# EasyEDA Pro project PowerManager.eprj

# Schematic Schematic1
Create Date: 2024-06-30; Page Name: P1; Project Name: PowerManager; Schematic Name: Schematic1; Update Date: 2024-08-08; Company: 嘉立创EDA; Page Size: A4; Version: V1.0
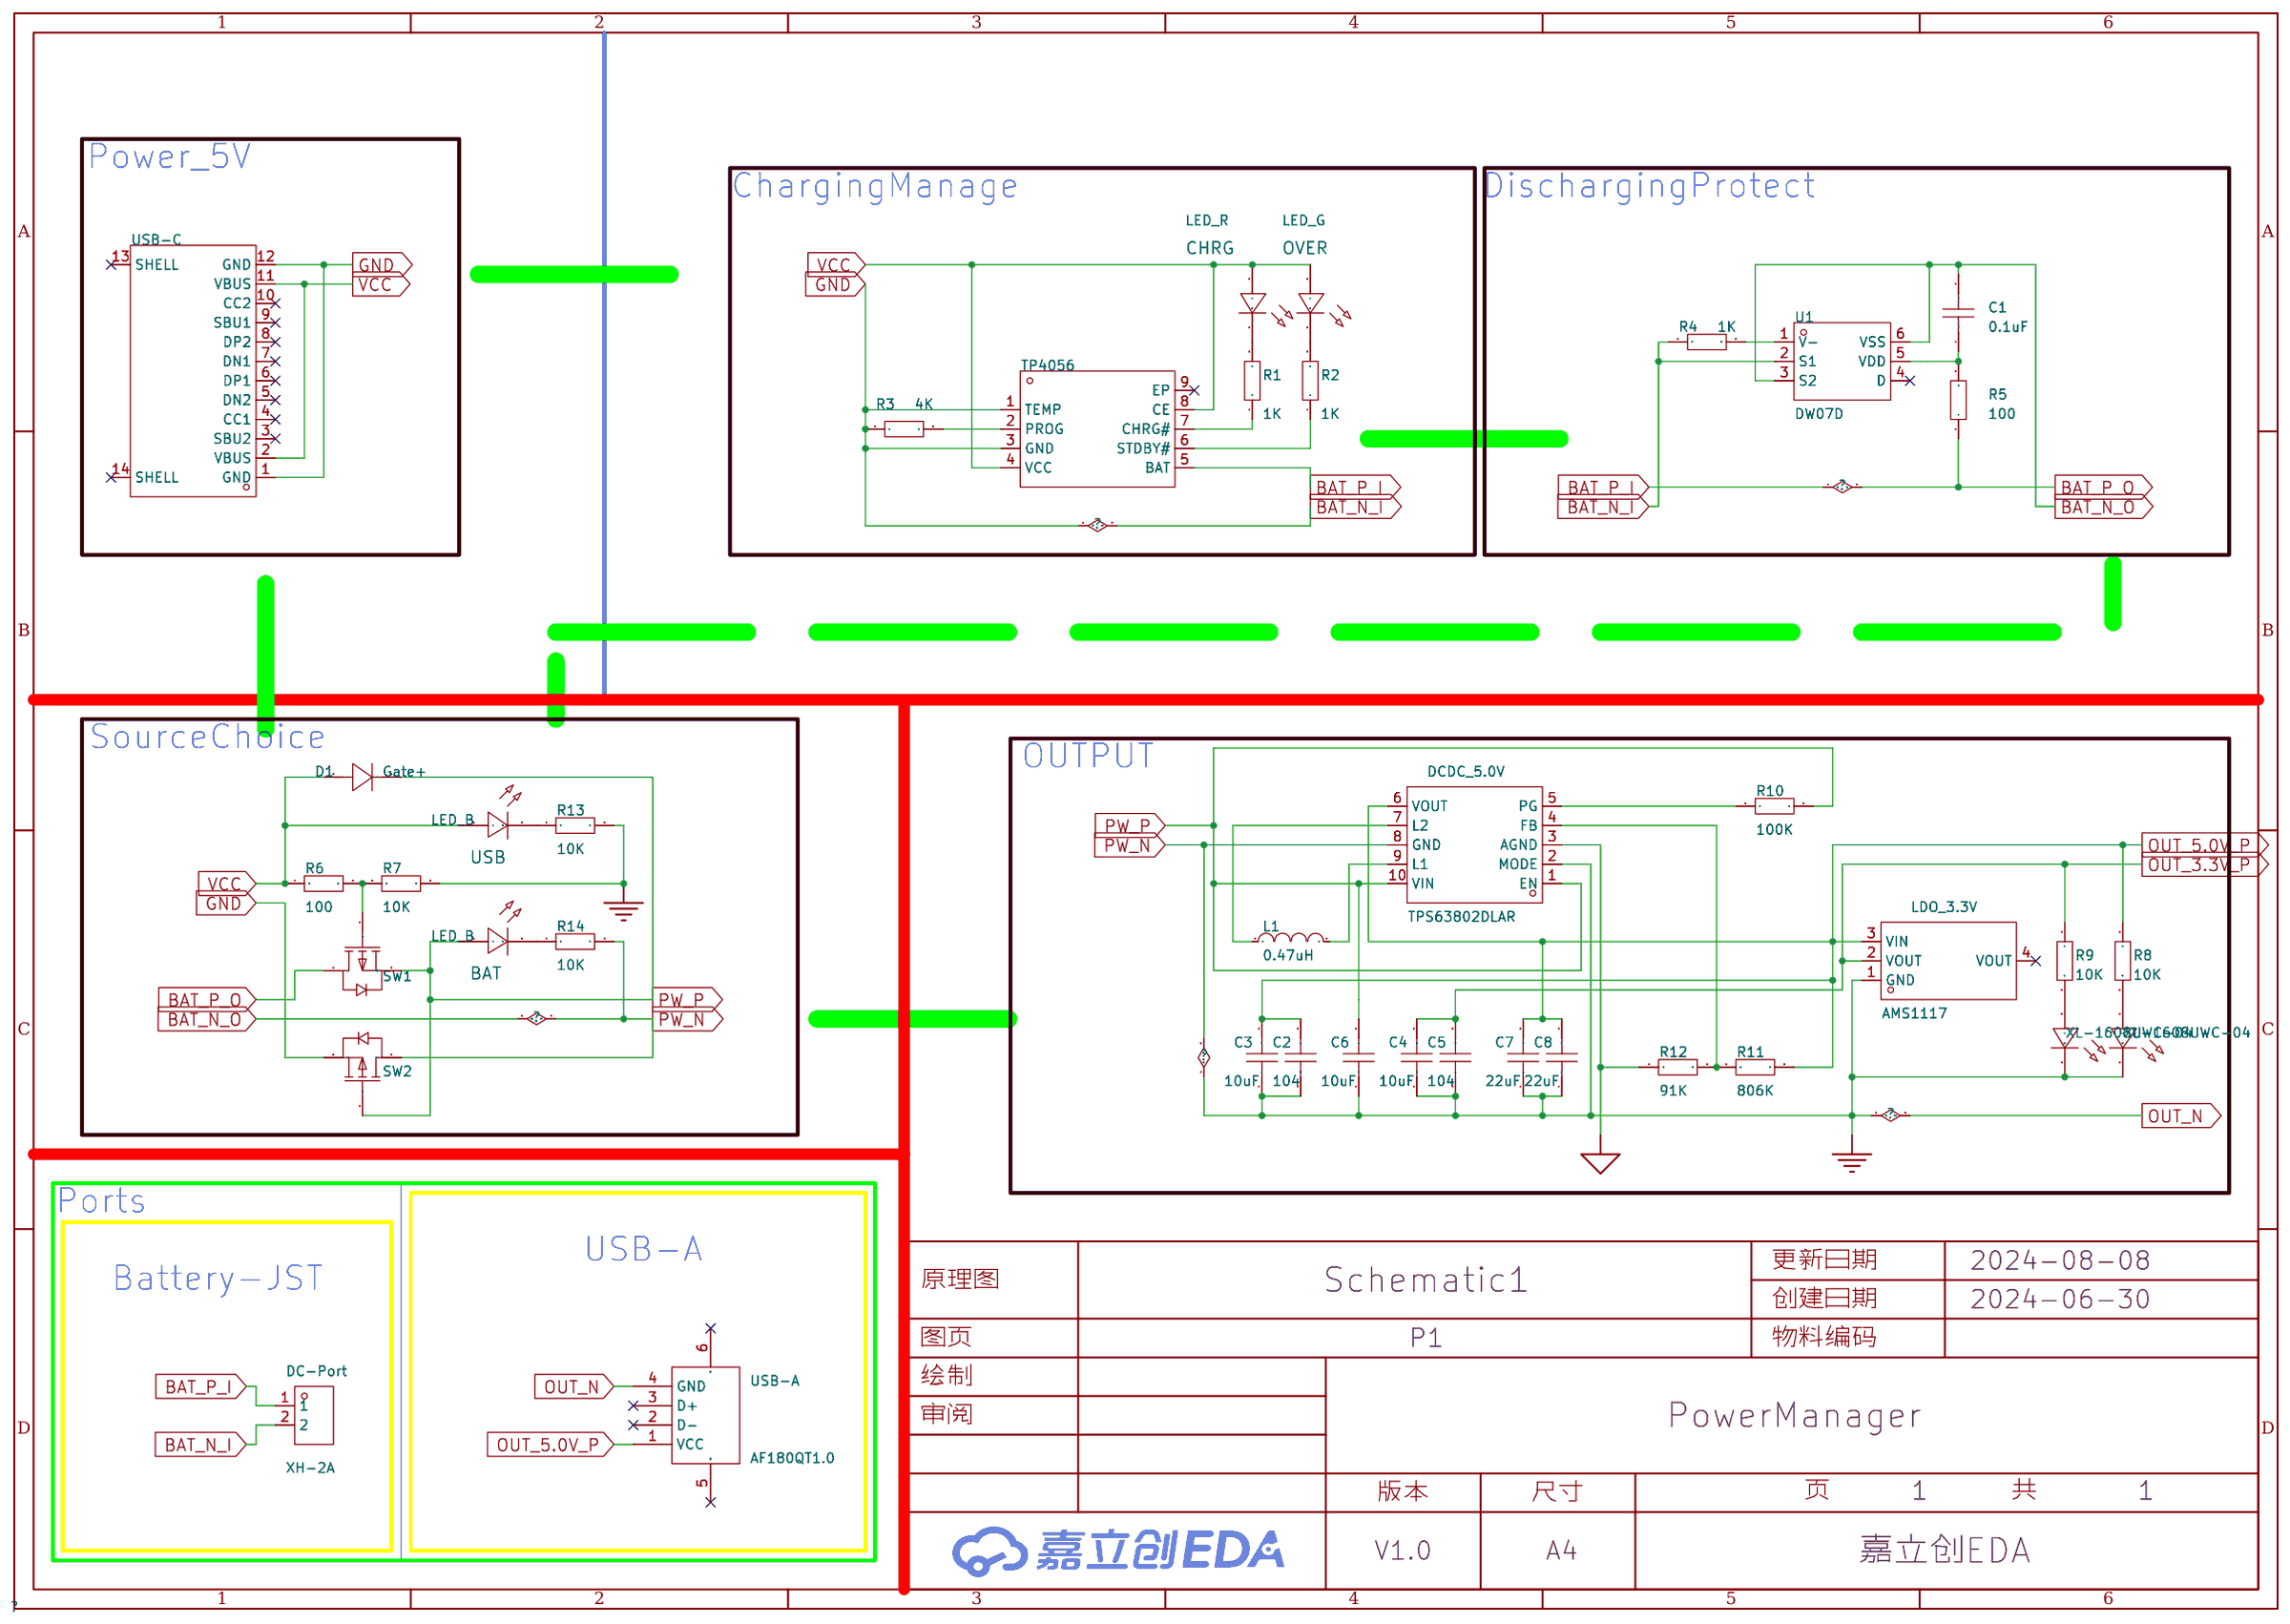
[diagram p0: schematic sheet]

## Parts
3.3V  XL-1608UWC-04  [LED0603-RD_WHITE]
5.0V  XL-1608UWC-04  [LED0603-RD_WHITE]
BAT  LED_B  [LED0603-RD_BLUE]
C1  0.1uF  [C0603]
C2  104  [C0603]
C3  10uF  [C0603]
C4  104  [C0603]
C5  10uF  [C0603]
C6  10uF  [C0603]
C7  22uF  [C0603]
C8  22uF  [C0603]
CHRG  LED_R  [LED_0603]
DC-Port  XH-2A  [CONN-TH_2P-P2.50_HCTL_XH-2A-X]
DCDC_5.0V  TPS63802DLAR  [VSON-10_L3.0-W2.0-P0.50-TL]
Gate+  D1  [SMA_1N4007]
L1  0.47uH  [L0603]
LDO_3.3V  AMS1117  [SOT-223-3_L6.5-W3.4-P2.30-LS7.0-BR]
OVER  LED_G  [LED0603-RD_GREEN]
R1  1K  [R0603]
R2  1K  [R0603]
R3  4K  [R0603]
R4  1K  [R0603]
R5  100  [R0603]
R6  100  [R0603]
R7  10K  [R0603]
R8  10K  [R0603]
R9  10K  [R0603]
R10  100K  [R0603]
R11  806K  [R0603]
R12  91K  [R0603]
R13  10K  [R0603]
R14  10K  [R0603]
SW1  AO3401A  [SOT-23_L2.9-W1.3-P1.90-LS2.4-BR]
SW2  AO3401A  [SOT-23_L2.9-W1.3-P1.90-LS2.4-BR]
TP4056  TP4056  [ESOP-8_L4.9-W3.9-P1.27-LS6.0-BL-EP]
Type-C  USB-C  [USB-C-SMD_TYPE-C-6PIN-2MD-073]
U1  DW07D  [SOT-23-6_L2.9-W1.6-P0.95-LS2.8-BR]
USB  LED_B  [LED0603-RD_BLUE]
USB-A  AF180QT1.0  [USB-A-SMD_AF180QT1.0]

## Library data of the parts
3.3V 5.0V = XL-1608UWC-04: 发光颜色:白色;功率:80mW;正向电流:25mA;主波长:-;透镜颜色:黄色透镜;色温:13700K~19000K;发光角度:120°;载带方式:正贴;工作温度:-30℃~+85℃;; Supplier Part: C965808; Manufacturer: XINGLIGHT(成兴光); Supplier Footprint: 0603; JLCPCB Part Class: Extended Part; Datasheet: https://atta.szlcsc.com/upload/public/pdf/source/20221102/585FFDAF9A16AAB1CA7BDF9640D81A72.pdf; Supplier: LCSC; Emitted Color: 白色; Power Dissipation: 80mW; Forward Current: 25mA; Lens Color: 黄色透镜; Color Temperature: 13700K~19000K; Viewing Angle: 120°; Mounting Sytle: 正贴; Operating Temperature: -30℃~+85℃
BAT USB = XL-1608UBC-04: 发光颜色:蓝色;功率:80mW;正向电流:25mA;主波长:460nm~469nm;透镜颜色:无色透明透镜;色温:-;发光角度:120°;载带方式:正贴;工作温度:-30℃~+85℃;; Supplier Part: C965807; Manufacturer: XINGLIGHT(成兴光); Supplier Footprint: 0603; JLCPCB Part Class: Extended Part; Datasheet: https://atta.szlcsc.com/upload/public/pdf/source/20240218/F76B043D1CDACE9DB8357580572EF0D5.pdf; Supplier: LCSC; Emitted Color: 蓝色; Power Dissipation: 80mW; Forward Current: 25mA; Dominant Wavelength: 460nm~469nm; Peak Wavelength: 475nm; Lens Color: 无色透明透镜; Viewing Angle: 120°; Mounting Sytle: 正贴; Operating Temperature: -30℃~+85℃
C1-C8 = CAP_0603: Supplier Footprint: 0603
CHRG = LED_0603-R: Supplier Footprint: 0603
DC-Port = XH-2A: 插针结构:1x2P;间距:2.5mm;安装方式:直插;参考系列:XH;总PIN数:2P;排数:1;每排PIN数:2;行距:-;额定电流:3A;触头材质:黄铜;触头镀层:锡;工作温度范围:-25℃~+85℃;; LCSC Part Name: 1x2P 间距:2.5mm 直插 系列:XH; Supplier Part: C2908600; Manufacturer: HCTL(华灿天禄); Supplier Footprint: 插件,P=2.5mm; Datasheet: https://atta.szlcsc.com/upload/public/pdf/source/20230711/68D365716984B4AFE576D1D73D61B465.pdf; Supplier: LCSC; Pins Structure: 1x2P; Pitch: 2.5mm; Mounting Style: 直插; Reference Series: XH; Number of Pins: 2P; Number of Rows: 1; Number of PINs Per Row: 2; Current Rating (Max): 3A; Contact Material: 黄铜; Contact Plating: 锡; Operating Temperature Range: -25℃~+85℃
DCDC_5.0V = TPS63802DLAR_C2845237: Supplier Part: C2845237; Manufacturer: TI(德州仪器); Supplier Footprint: VSON-10(2x3); Datasheet: https://www.ti.com/cn/lit/gpn/tps63802; Supplier: LCSC
Gate+ = D_1N4007: Supplier Footprint: SMA
L1 = L_0603
LDO_3.3V = AMS1117-3.3_C6186: 输出类型:固定;最大输入电压:-;输出电压:3.3V;最大输出电流:1A;电源纹波抑制比(PSRR):72dB@(120Hz);输出极性:正极;; LCSC Part Name: 输出3.3V 1A; Supplier Part: C6186; Manufacturer: AMS; Supplier Footprint: SOT-223; Datasheet: https://atta.szlcsc.com/upload/public/pdf/source/20180727/C6186_7A095716F0823C02F1997A905E26C086.pdf; Supplier: LCSC; Output Type: 固定; Output Voltage: 3.3V; MAX Output Current: 1A; Power Supply Rejection Ratio (PSRR): 72dB@(120Hz); Dropout Voltage: 1.3V@(800mA); Output Polarity: 正极; Number of Outputs: 1
OVER = XL-1608UGC-04: 灯头类型:-;发光颜色:翠绿色;正向电压(VF):-;功率:80mW;正向电流:25mA;主波长:516nm~525nm;二极管配置:独立二极管;透镜颜色:无色透明透镜;色温:-;发光强度:-;发光角度:120°;载带方式:正贴;工作温度:-30℃~+85℃;; Supplier Part: C965804; Manufacturer: XINGLIGHT(成兴光); Manufacturer Part: LED_R; Supplier Footprint: 0603; JLCPCB Part Class: Extended Part; Datasheet: https://atta.szlcsc.com/upload/public/pdf/source/20221102/520D6E465E5CFD1609C8A4DBC80D4018.pdf; Supplier: LCSC; Emitted Color: 翠绿色; Power Dissipation: 80mW; Forward Current: 25mA; Dominant Wavelength: 516nm~525nm; Peak Wavelength: 534nm; Diode Configuration: 独立二极管; Lens Color: 无色透明透镜; Viewing Angle: 120°; Mounting Sytle: 正贴; Operating Temperature: -30℃~+85℃
R1-R14 = Res_0603: Supplier Footprint: 0603
SW1 SW2 = AO3401A_C15127: 类型:1个P沟道;漏源电压(Vdss):30V;连续漏极电流(Id):4A;功率(Pd):1.4W;导通电阻(RDS(on)@Vgs,Id):44mΩ@10V,4.3A;阈值电压(Vgs(th)@Id):1.3V@250uA;; LCSC Part Name: 1个P沟道 耐压:30V 电流:4A; Supplier Part: C15127; Manufacturer: AOS; Supplier Footprint: SOT-23; Datasheet: https://atta.szlcsc.com/upload/public/pdf/source/20160507/1462613609053.pdf; Supplier: LCSC; Type: 1个P沟道; Drain Source Voltage (Vdss): 30V; Continuous Drain Current (Id): 4A; Power Dissipation (Pd): 1.4W; Drain Source On Resistance (RDS(on)@Vgs,Id): 44mΩ@10V,4.3A; Gate Threshold Voltage (Vgs(th)@Id): 1.3V@250uA; Total Gate Charge (Qg@Vgs): 12.2nC@4.5V; Input Capacitance (Ciss@Vds): 1.2nF@15V; Operating Temperature: -55℃~+150℃@(Tj)
TP4056 = TP4056_C725790: Supplier Part: C725790; Manufacturer: UMW(友台半导体); Supplier Footprint: ESOP-8; Datasheet: https://atta.szlcsc.com/upload/public/pdf/source/20231109/CF74897CE79A500F7FE27A45ADCCC631.pdf; Supplier: LCSC
Type-C = TYPE-C 16PIN 2MD(073): 连接器类型:Type-C;标准:-;公母:母;端口数量:1;触点数量:16P;安装方式:卧贴;额定电流 - 电源:5A;工作温度范围:-25℃~+85℃;; LCSC Part Name: Type-C 母 卧贴; Supplier Part: C2765186; Manufacturer: SHOU HAN(首韩); Supplier Footprint: SMD; Datasheet: https://atta.szlcsc.com/upload/public/pdf/source/20211123/39B17C16241EAC15C5E277BDA434118E.pdf; Supplier: LCSC; Gender: 母; Number of Ports: 1; Number of Contacts: 16P; Mounting Style: 卧贴; Current Rating - Power (Max): 5A; Operating Temperature Range: -25℃~+85℃
U1 = DW07D: 二合一锂电池保护IC; Supplier Part: C89497; Manufacturer: FM(富满); Supplier Footprint: SOT-23-6; JLCPCB Part Class: 扩展库; Datasheet: https://atta.szlcsc.com/upload/public/pdf/source/20161128/1480332603746.pdf; Supplier: LCSC
USB-A = AF180QT1.0: 连接器类型:Type-A;标准:USB 2.0;公母:母;端口数量:1;触点数量:4P;安装方式:卧贴;额定电流 - 电源:-;工作温度范围:-;; LCSC Part Name: Type-A 母 卧贴; Supplier Part: C404963; Manufacturer: SHOU HAN(首韩); Supplier Footprint: SMD; Datasheet: https://atta.szlcsc.com/upload/public/pdf/source/20190722/C404963_FD7C48D0FD141784D3899E0BE1E5ED69.pdf; Supplier: LCSC; Connector Type: Type-A; Standard: USB 2.0; Gender: 母; Number of Ports: 1; Number of Contacts: 4P; Mounting Style: 卧贴

## Nets
AGND: DCDC_5.0V.3(AGND) R12.1
DGND: 3.3V.1(C) 5.0V.1(C) C1.2 C2.1 C3.1 C4.1 C5.1 C6.1 C7.1 C8.1 DCDC_5.0V.2(MODE) DCDC_5.0V.8(GND) LDO_3.3V.1(GND) R14.2 SW2.3(D) U1.3(S2) U1.6(VSS) USB-A.4(GND)
GND: DC-Port.2 R3.1 R4.1 R7.2 R13.2 SW2.2(S) TP4056.1(TEMP) TP4056.3(GND) Type-C.1(GND) Type-C.12(GND) U1.2(S1)
VCC: CHRG.2(A) Gate+.2(A) OVER.2(A) R6.1 TP4056.4(VCC) TP4056.8(CE) Type-C.2(VBUS) Type-C.11(VBUS) USB.2(A)
BAT_P_I: DC-Port.1 R5.1 SW1.3(D) TP4056.5(BAT)
OUT_3.3V_P: C4.2 C5.2 LDO_3.3V.2(VOUT) R9.1
OUT_5.0V_P: C2.2 C3.2 C7.2 C8.2 DCDC_5.0V.6(VOUT) LDO_3.3V.3(VIN) R8.1 R11.2 USB-A.1(VCC)
PW_P: BAT.2(A) C6.2 DCDC_5.0V.1(EN) DCDC_5.0V.10(VIN) Gate+.1(K) R10.1 SW1.2(S) SW2.1(G)
$1N753: R3.2 TP4056.2(PROG)
$1N897: OVER.1(C) R2.2
$1N964: CHRG.1(C) R1.2
$1N968: R1.1 TP4056.7(CHRG#)
$1N975: R2.1 TP4056.6(STDBY#)
$1N1874: R6.2 R7.1 SW1.1(G)
$1N7526: 5.0V.2(A) R8.2
$1N7553: 3.3V.2(A) R9.2
$1N9793: DCDC_5.0V.9(L1) L1.2
$1N9797: DCDC_5.0V.7(L2) L1.1
$1N10563: DCDC_5.0V.5(PG) R10.2
$1N11159: DCDC_5.0V.4(FB) R11.1 R12.2
$1N18992: R13.1 USB.1(C)
$1N19087: BAT.1(C) R14.1
$1N21323: R4.2 U1.1(V-)
$1N21351: C1.1 R5.2 U1.5(VDD)

Not connected (* = marked no-connect by the designer): LDO_3.3V 4(VOUT)*; TP4056 9(EP)*; Type-C 3(SBU2)* 4(CC1)* 5(DN2)* 6(DP1)* 7(DN1)* 8(DP2)* 9(SBU1)* 10(CC2)* 13(SHELL)* 14(SHELL)*; U1 4(D)*; USB-A 2(D-)* 3(D+)* 5(SH1)* 6(SH2)*

## Notes on the sheet
- Power_5V
- ChargingManage
- DischargingProtect
- SourceChoice
- OUTPUT
- Ports
- USB-A
- Battery-JST

# Board PCB1
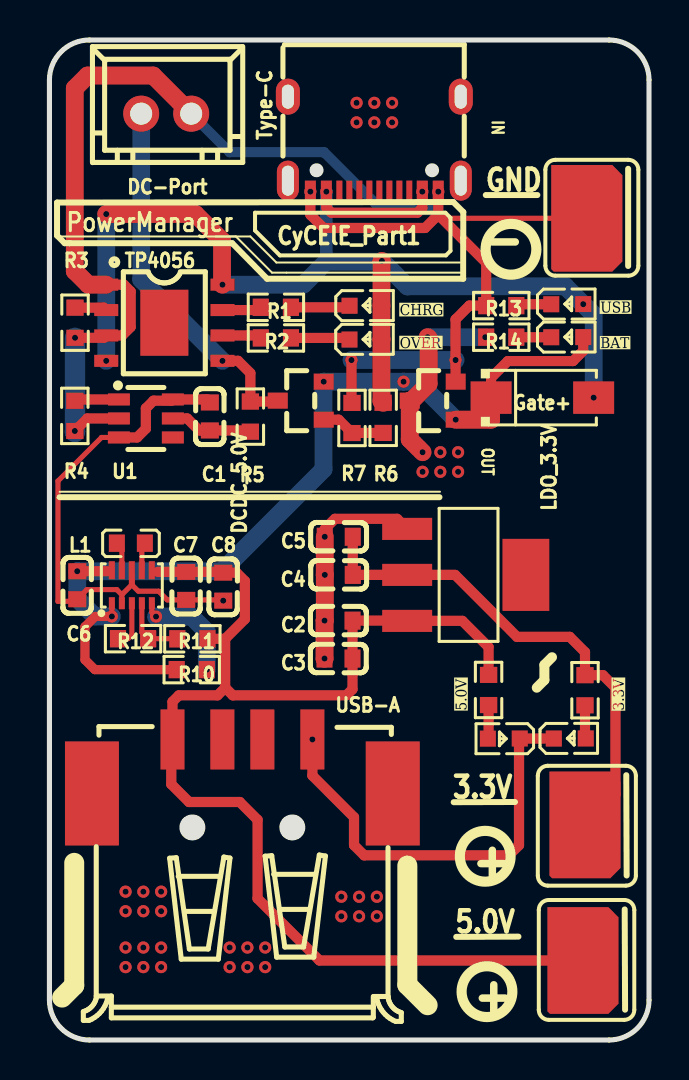
[diagram p1: board, top side]
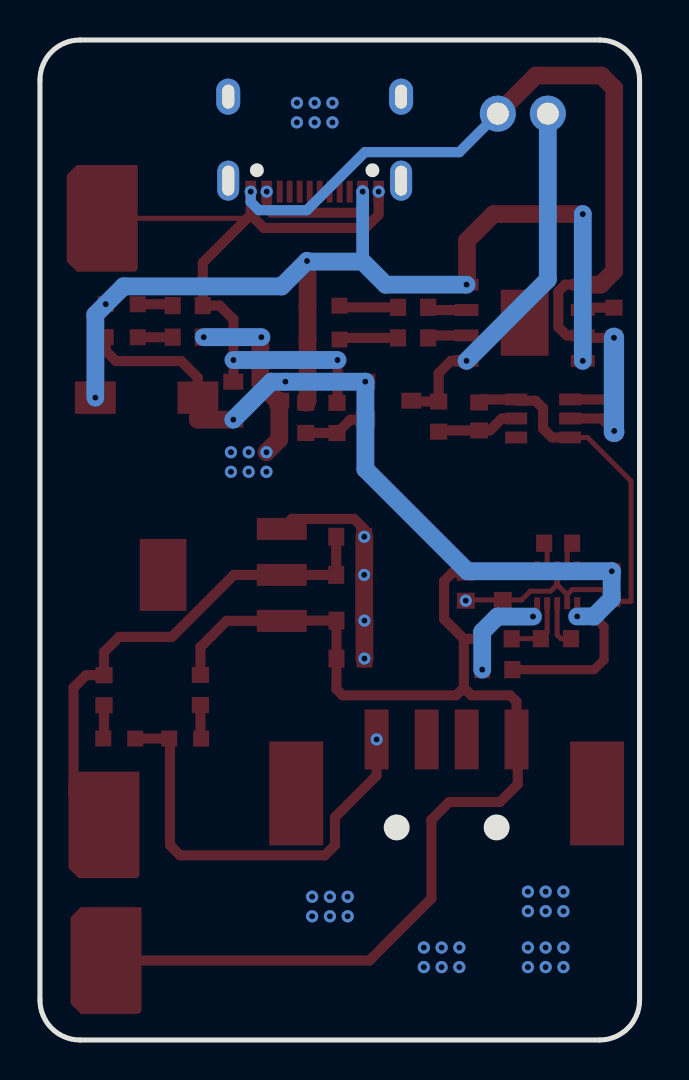
[diagram p2: board, bottom side, seen from below]

Outline 30 x 50 mm; copper layers: Top Layer, Bottom Layer. Coordinates in mm from the lower left corner of the outline.
Outline path: 0,48 0,2 arc(0.59,0.59) 2,0 28,0 arc(29.41,0.59) 30,2 30,48 arc(29.41,49.41) 28,50 2,50 arc(0.59,49.41) 0,48
Stack: Top Layer 0.035mm / Dielectric1 1.51mm FR4 er 4.5 / Bottom Layer 0.035mm

## Design rules (mm)
template: 自定义配置
spacing copperThickness1oz (default): track to track 0.102, other pairs 0.152 to 0.3
spacing copperThickness2oz: track to track 0.203, other pairs 0.152 to 0.3
track width copperThickness1oz (default): min 0.127, default 0.254, max 2.54
track width copperThickness2oz: min 0.203, default 0.254, max 2.54
differential pair differentialPair (default): width min 0.127, default 0.254, max 2.54; gap min 0.152, default 0.152
via viaSize (default): diameter min 0.5, default 0.61, max 10; hole min 0.3, default 0.305, max 6.3
pour e87 uses 全铺满

## Placement (name value [footprint] x y rotation side)
3.3V  XL-1608UWC-04  [LED0603-RD_WHITE]  26.03 15.08 0 top
5.0V  XL-1608UWC-04  [LED0603-RD_WHITE]  22.73 15.07 180 top
BAT  LED_B  [LED0603-RD_BLUE]  25.91 35.14 0 top
C1  0.1uF  [C0603]  8.03 31.18 90 top
C2  104  [C0603]  14.47 20.97 0 top
C3  10uF  [C0603]  14.46 19.07 0 top
C4  104  [C0603]  14.48 23.26 0 top
C5  10uF  [C0603]  14.48 25.16 0 top
C6  10uF  [C0603]  1.39 22.74 90 top
C7  22uF  [C0603]  6.84 22.7 90 top
C8  22uF  [C0603]  8.7 22.67 90 top
CHRG  LED_R  [LED_0603]  15.87 36.72 0 top
DC-Port  XH-2A  [CONN-TH_2P-P2.50_HCTL_XH-2A-X]  5.84 46.32 0 top
DCDC_5.0V  TPS63802DLAR  [VSON-10_L3.0-W2.0-P0.50-TL]  4.12 22.66 90 top
Gate+  D1  [SMA_1N4007]  24.66 32.12 0 top
L1  0.47uH  [L0603]  4.07 24.84 180 top
LDO_3.3V  AMS1117  [SOT-223-3_L6.5-W3.4-P2.30-LS7.0-BR]  20.87 23.26 180 top
NOREF  -  [Pad_e1452]  26.7 3.97 0 top
NOREF#2  -  [Pad_e1453]  26.89 41.08 0 top
NOREF#3  -  [Pad_e1450]  26.8 10.76 0 top
OVER  LED_G  [LED0603-RD_GREEN]  15.81 35.03 0 top
R1  1K  [R0603]  11.33 36.63 0 top
R2  1K  [R0603]  11.33 35.1 0 top
R3  4K  [R0603]  1.28 35.86 90 top
R4  1K  [R0603]  1.27 31.2 90 top
R5  100  [R0603]  10.05 31.17 270 top
R6  100  [R0603]  16.7 31.11 270 top
R7  10K  [R0603]  15.14 31.1 90 top
R8  10K  [R0603]  21.97 17.5 270 top
R9  10K  [R0603]  26.8 17.49 270 top
R10  100K  [R0603]  7.12 18.52 0 top
R11  806K  [R0603]  7.15 20.06 0 top
R12  91K  [R0603]  4.19 20.07 0 top
R13  10K  [R0603]  22.61 36.72 180 top
R14  10K  [R0603]  22.61 35.14 180 top
SW1  AO3401A  [SOT-23_L2.9-W1.3-P1.90-LS2.4-BR]  12.57 31.97 0 top
SW2  AO3401A  [SOT-23_L2.9-W1.3-P1.90-LS2.4-BR]  19.18 31.97 0 top
TP4056  TP4056  [ESOP-8_L4.9-W3.9-P1.27-LS6.0-BL-EP]  5.75 35.86 270 top
Type-C  USB-C  [USB-C-SMD_TYPE-C-6PIN-2MD-073]  16.26 44.79 180 top
U1  DW07D  [SOT-23-6_L2.9-W1.6-P0.95-LS2.8-BR]  4.83 31.08 180 top
USB  LED_B  [LED0603-RD_BLUE]  25.91 36.79 0 top
USB-A  AF180QT1.0  [USB-A-SMD_AF180QT1.0]  9.65 13.68 0 top

## Footprints (pads in the part's own frame, mm; a bottom-side part is the same pattern mirrored in y, then rotated)
C0603
  rect 0.8x0.9 smd: 1(-0.7,0) 2(0.7,0)
CONN-TH_2P-P2.50_HCTL_XH-2A-X
  round 1.8 hole 1.1: 1(-1.251,0) 2(1.251,0)
ESOP-8_L4.9-W3.9-P1.27-LS6.0-BL-EP
  rect 0.6x1.2 smd: 1(-1.905,-2.909) 2(-0.635,-2.909) 3(0.635,-2.909) 4(1.905,-2.909) 5(1.905,2.909) 6(0.635,2.909) 7(-0.635,2.909) 8(-1.905,2.909)
  rect 3.3x2.4 smd: 9(0,0)
L0603
  rect 0.8x0.864 smd: 1(-0.7,0) 2(0.7,0)
LED0603-RD_BLUE
  rect 0.8x0.8 smd: 1(-0.799,-0.004) 2(0.799,0.004)
LED0603-RD_GREEN
  rect 0.8x0.8 smd: 1(-0.799,-0.004) 2(0.799,0.004)
LED0603-RD_WHITE
  rect 0.8x0.8 smd: 1(-0.799,-0.004) 2(0.799,0.004)
LED_0603
  rect 0.8x0.8 smd: 1(-0.851,-0.01) 2(0.75,-0.005)
Pad_e1450
  custom 3.556x5.334 smd: 001(0,0)
Pad_e1452
  custom 3.556x5.334 smd: 001(0,0)
Pad_e1453
  custom 3.556x5.334 smd: 001(0,0)
R0603
  rect 0.806x0.864 smd: 1(-0.753,0) 2(0.753,0)
SMA_1N4007
  rect 2.046x1.62 smd: 1(-2.566,0) 2(2.566,0)
SOT-23-6_L2.9-W1.6-P0.95-LS2.8-BR
  rect 1.1x0.6 smd: 1(1.35,-0.95) 2(1.35,0) 3(1.35,0.95) 4(-1.35,0.95) 5(-1.35,0) 6(-1.35,-0.95)
SOT-23_L2.9-W1.3-P1.90-LS2.4-BR
  rect 1x0.8 smd: 1(1.15,-0.95) 2(1.15,0.95) 3(-1.15,0)
SOT-223-3_L6.5-W3.4-P2.30-LS7.0-BR
  rect 2.5x1.1 smd: 1(2.97,-2.3) 2(2.97,0) 3(2.97,2.3)
  rect 2.34x3.6 smd: 4(-2.97,0)
USB-A-SMD_AF180QT1.0
  rect 1.2x3 smd: 1(-3.495,1.35) 2(-1,1.35) 3(1,1.35) 4(3.505,1.35)
  rect 2.7x5.2 smd: 5(7.525,-1.35) 6(-7.525,-1.35)
USB-C-SMD_TYPE-C-6PIN-2MD-073
  rect 0.55x1.1 smd: 1(-3.2,2.375) 2(-2.4,2.375) 11(2.4,2.375) 12(3.2,2.375)
  rect 0.3x1.1 smd: 3(-1.75,2.375) 4(-1.25,2.375) 5(-0.75,2.375) 6(-0.25,2.375) 7(0.25,2.375) 8(0.75,2.375) 9(1.25,2.375) 10(1.75,2.375)
  oval 1.1x2 hole 0.6x1.5: 13(-4.325,1.825) 14(4.325,1.825)
  oval 1.2x1.8 hole 0.6x1.2: 13(-4.325,-2.375) 14(4.325,-2.375)
VSON-10_L3.0-W2.0-P0.50-TL
  rect 0.6x0.3 smd: 1(-0.825,1) 2(-0.825,0.5) 3(-0.825,0) 4(-0.825,-0.5) 5(-0.825,-1)
  rect 0.9x0.3 smd: 6(0.825,-1) 7(0.825,-0.5) 9(0.825,0.5) 10(0.825,1)
  rect 1.3x0.3 smd: 8(0.625,0)

## Nets
As in the schematic, except:
GND: DC-Port.2 NOREF#2.001 R3.1 R4.1 R7.2 R13.2 SW2.2 TP4056.1 TP4056.3 Type-C.1 Type-C.12 U1.2
OUT_3.3V_P: C4.2 C5.2 LDO_3.3V.2 NOREF#3.001 R9.1
OUT_5.0V_P: C2.2 C3.2 C7.2 C8.2 DCDC_5.0V.6 LDO_3.3V.3 NOREF.001 R8.1 R11.2 USB-A.1

Pads without a net: LDO_3.3V 4; TP4056 9; Type-C 3 4 5 6 7 8 9 10 13 14; U1 4; USB-A 2 3 5 6

## Via types
v1: diameter 0.61, hole 0.305, Top Layer to Bottom Layer, 66 vias

## Routing (per net, layer and track width the routed paths; a pad name or vN(x,y) marks a point on that pad's centre or on a via; arc(x,y) is an arc through that point)
AGND: length 2.4
  Top Layer w0.254: DCDC_5.0V.3 4.12,20.25 3.94,20.07 R12.1
DGND: length 67.8
  Top Layer w0.254: 4.12,22.77 3.62,22.27 ; 4.12,22.77 DCDC_5.0V.8 ; 4.12,22.77 4.45,22.44 5.46,22.44 5.9,22 C7.1 8.66,22 v1(8.7,21.97) ; 3.62,22.27 DCDC_5.0V.2 ; 3.62,22.27 3.37,22.52 1.87,22.52 C6.1 ; 1.05,21.93 0.43,21.93 0.43,27.95 2.61,30.13 U1.3
  Top Layer w0.508: U1.3 4.38,30.13 4.83,30.57 4.83,31.58 5.21,31.97 6.12,31.97 U1.6 7.88,32.03 C1.2 ; v1(13.16,15.03) 13.16,13.22 15.24,11.14 15.24,9.74 15.75,9.23 22.99,9.23 23.5,9.74 23.5,15.04 5.0V.1 25.1,15.07 25.11,15.07 ; v1(13.78,25.16) 13.78,25.55 14.28,26.06 17.4,26.06 LDO_3.3V.1
  Top Layer w0.889: C3.1 v1(13.77,19.07) v1(13.77,20.97) 13.78,20.98 v1(13.78,23.26) 13.78,23.26 v1(13.78,25.16) ; v1(18.92,35.14) 18.97,35.09 18.97,32.81 18.13,31.97 SW2.3 18.03,30.03 v1(18.67,29.39)
  Bottom Layer w0.889: v1(18.92,35.14) v1(21.81,35.14)
  vias: v1(3.81,7.42) v1(3.81,6.44) v1(3.81,4.62) v1(3.81,3.64) v1(4.7,7.42) v1(4.7,6.44) v1(4.7,4.62) v1(4.7,3.64) v1(5.59,7.42) v1(5.59,6.44) v1(5.59,4.62) v1(5.59,3.64) v1(9.02,4.62) v1(9.02,3.64) v1(9.91,4.62) v1(9.91,3.64) v1(10.79,4.62) v1(10.79,3.64) v1(14.6,7.16) v1(14.6,6.19) v1(15.49,7.16) v1(15.49,6.19) v1(16.38,7.16) v1(16.38,6.19) v1(18.67,28.41) v1(19.56,29.39) v1(19.56,28.41) v1(20.45,29.39) v1(20.45,28.41)
GND: length 80.6
  Top Layer w0.254: NOREF#2.001 19.63,41.08
  Top Layer w0.508: v1(13.06,42.42) 13.06,41.26 13.72,40.6 18.8,40.6 19.46,41.26 ; SW2.2 20.32,32.92 v1(20.32,34) 20.32,36.03 21.01,36.72 R13.2 21.85,38.86 19.46,41.26 ; v1(1.28,35.11) 2.72,35.11 2.84,35.23 3.64,35.23 4.06,35.65 4.06,37.43 3.72,37.77 TP4056.1 ; 19.46,41.26 v1(19.46,42.42) ; v1(1.27,30.45) 1.9,31.08 U1.2 ; R7.2 15.11,31.88 v1(15.11,34)
  Top Layer w0.889: TP4056.1 1.95,37.77 1.27,38.44 1.27,47.59 1.91,48.22 5.19,48.22 7.09,46.32
  Bottom Layer w0.508: v1(19.46,42.42) 19.46,41.9 19.05,41.49 16.64,41.49 13.74,44.39 9.02,44.39 7.09,46.32
  Bottom Layer w0.889: v1(20.32,34) v1(15.11,34)
  Bottom Layer w1.016: 1.27,30.4 1.28,30.42 v1(1.28,35.11)
  vias: v1(15.37,46.86) v1(15.37,45.88) v1(16.26,46.86) v1(16.26,45.88) v1(17.15,46.86) v1(17.15,45.88)
VCC: length 57.5
  Top Layer w0.508: v1(13.86,42.42) 13.86,41.61 14.11,41.36 18.41,41.36 18.66,41.61 v1(18.66,42.42)
  Top Layer w0.889: v1(8.66,37.77) 8.64,37.79 8.64,39.97 7.31,41.3 v1(2.84,41.3) ; R6.1 16.61,31.94 OVER.2 16.62,35.03 CHRG.2 16.62,38.93 v1(16.64,38.95)
  Bottom Layer w0.635: 13.86,38.92 v1(13.86,42.42)
  Bottom Layer w0.889: v1(27.23,32.12) 27.23,36.27 v1(26.71,36.79) 25.82,37.68 17.91,37.68 v1(16.64,38.95) 16.61,38.92 13.86,38.92 12.7,37.77 v1(8.66,37.77) ; v1(2.84,41.3) v1(2.84,33.96)
BAT_P_I: length 18.5
  Top Layer w0.508: SW1.3 11.38,31.92 R5.1 10.05,33.34 9.44,33.96 v1(8.66,33.96)
  Bottom Layer w0.889: DC-Port.1 4.59,38.02 v1(8.66,33.96)
OUT_3.3V_P: length 25.5
  Top Layer w0.508: C5.2 15.18,23.26 C4.2 LDO_3.3V.2 20.3,23.26 23.4,20.16 26.03,20.16 26.8,19.39 R9.1 27.69,18.24 28.32,17.61 28.32,12.28 NOREF#3.001
OUT_5.0V_P: length 63.6
  Top Layer w0.508: R11.2 8.79,20.06 ; 8.79,20.06 9.78,21.04 9.78,22.95 9.36,23.37 C8.2 8.66,23.41 C7.2 5.42,23.41 ; 8.79,20.06 8.79,17.61 ; 8.79,17.61 8.41,17.23 6.48,17.23 6.16,16.91 USB-A.1 6.1,14.97 6.1,12.79 6.99,11.9 9.53,11.9 10.41,11.01 10.41,7.07 13.51,3.97 NOREF.001 ; 8.79,17.61 9.18,17.23 14.86,17.23 15.16,17.54 C3.2 15.16,20.97 C2.2 17.89,20.97 LDO_3.3V.3 20.66,20.96 21.97,19.65 R8.1
PW_P: length 49.6
  Top Layer w0.254: DCDC_5.0V.1 v1(3.12,21.18)
  Top Layer w0.457: 6.37,18.52 2.27,18.52 1.78,19.01 1.78,20.66 2.29,21.18 v1(3.12,21.18)
  Top Layer w0.508: v1(1.39,23.44) 2.92,23.44 ; Gate+.1 22.1,33.11 22.94,33.95 26.2,33.95 26.71,34.45 BAT.2
  Top Layer w0.889: v1(20.33,31.02) 22.1,31.02 Gate+.1
  Bottom Layer w0.889: v1(20.33,31.02) 18.43,32.92 v1(17.72,32.92) v1(13.72,32.92) 13.72,32.91 13.72,28.54 8.62,23.44 v1(1.39,23.44) 1.4,23.43 1.4,22.06 2.28,21.18 v1(3.12,21.18)
$1N753: length 1.6
  Top Layer w0.508: TP4056.2 2.72,36.62 R3.2
$1N897: length 3
  Top Layer w0.508: OVER.1 14.93,35.1 12.09,35.1
$1N964: length 3
  Top Layer w0.508: CHRG.1 14.94,36.63 R1.2
$1N968: length 2
  Top Layer w0.508: TP4056.7 10.44,36.5 R1.1
$1N975: length 2
  Top Layer w0.508: 8.66,35.23 10.45,35.23 R2.1
$1N1874: length 3.3
  Top Layer w0.508: SW1.1 14.47,31.02 R7.1 15.14,30.35 R6.2
$1N7526: length 1.7
  Top Layer w0.508: R8.2 21.97,15.11 5.0V.2
$1N7553: length 1.7
  Top Layer w0.508: R9.2 26.8,15.16 26.71,15.07
$1N9793: length 1.5
  Top Layer w0.254: L1.2 3.62,24.59 DCDC_5.0V.9
$1N9797: length 1.4
  Top Layer w0.254: DCDC_5.0V.7 4.62,24.69 L1.1
$1N10563: length 5.5
  Top Layer w0.254: DCDC_5.0V.5 5.12,21.38 v1(5.33,21.17)
  Bottom Layer w0.889: v1(5.33,21.17) 7.11,21.17 7.87,20.41 7.87,18.52
  vias: v1(7.87,18.52)
$1N11159: length 3.4
  Top Layer w0.254: DCDC_5.0V.4 4.62,20.38 R12.2 6.39,20.07 R11.1
$1N18992: length 1.5
  Top Layer w0.508: 24.85,36.79 23.43,36.79 R13.1
$1N19087: length 1.5
  Top Layer w0.508: R14.1 23.36,35.14 24.85,35.14
$1N21323: length 2.2
  Top Layer w0.508: U1.1 1.34,32.03 R4.2
$1N21351: length 4.2
  Top Layer w0.508: R5.2 9.99,30.48 C1.1 7.49,30.48 6.89,31.08 U1.5

## Copper pours and planes (outline as drawn; the poured copper is in the pictures)
AGND on Top Layer: 3.68,20.73 2.29,20.73 2.29,19.27 2.67,18.89 4.44,18.89 4.44,21.42 3.68,21.42
DGND on Top Layer: -0.38,29.55 1.65,29.55 2.61,30.5 4,30.5 4.32,30.82 4.32,33.07 7.33,33.07 7.37,33.11 7.37,38.82 8.08,39.54 24,39.54 25.6,37.94 32.26,37.94 34.29,35.9 34.29,-8.55 -11.94,-8.55 -25.4,4.92 -25.4,19.65 -15.62,29.43 -0.51,29.43
DGND on Bottom Layer: -1.09,30.4 31.62,30.4 31.62,-4.48 -1.09,-4.48
GND on Top Layer: -7.24,60.29 40.51,60.29 40.51,27.65 -7.24,27.65
GND on Bottom Layer: -1.14,51.52 32.13,51.52 32.89,52.29 32.89,42 30.86,39.97 32.07,29.84 -1.14,29.84

## Text on the board
Top Silkscreen Layer: OUT | IN | CyCElE_Part1 | PowerManager | 5.0V | GND | 3.3V | + | -
